# Altium schematic sheet CODEC 1 &  OUTPUT BUFFER.SchDoc: BULLSEYE
size A3; CompanyName: TYMPHANY; DrawnBy: Yetta.He; Organization: PABU; Address1: 11F,block A, CEC building,; Address2: No.2070 Shennan Zhong road,; Address3: Huaqiang North, Futian District,; Address4: Shenzhen,  Guang Dong, P.R.C 518000; DocumentNumber: 3; Revision: 0.0.5; SheetNumber: 3; SheetTotal: 7; Size: A3; Status: DP1
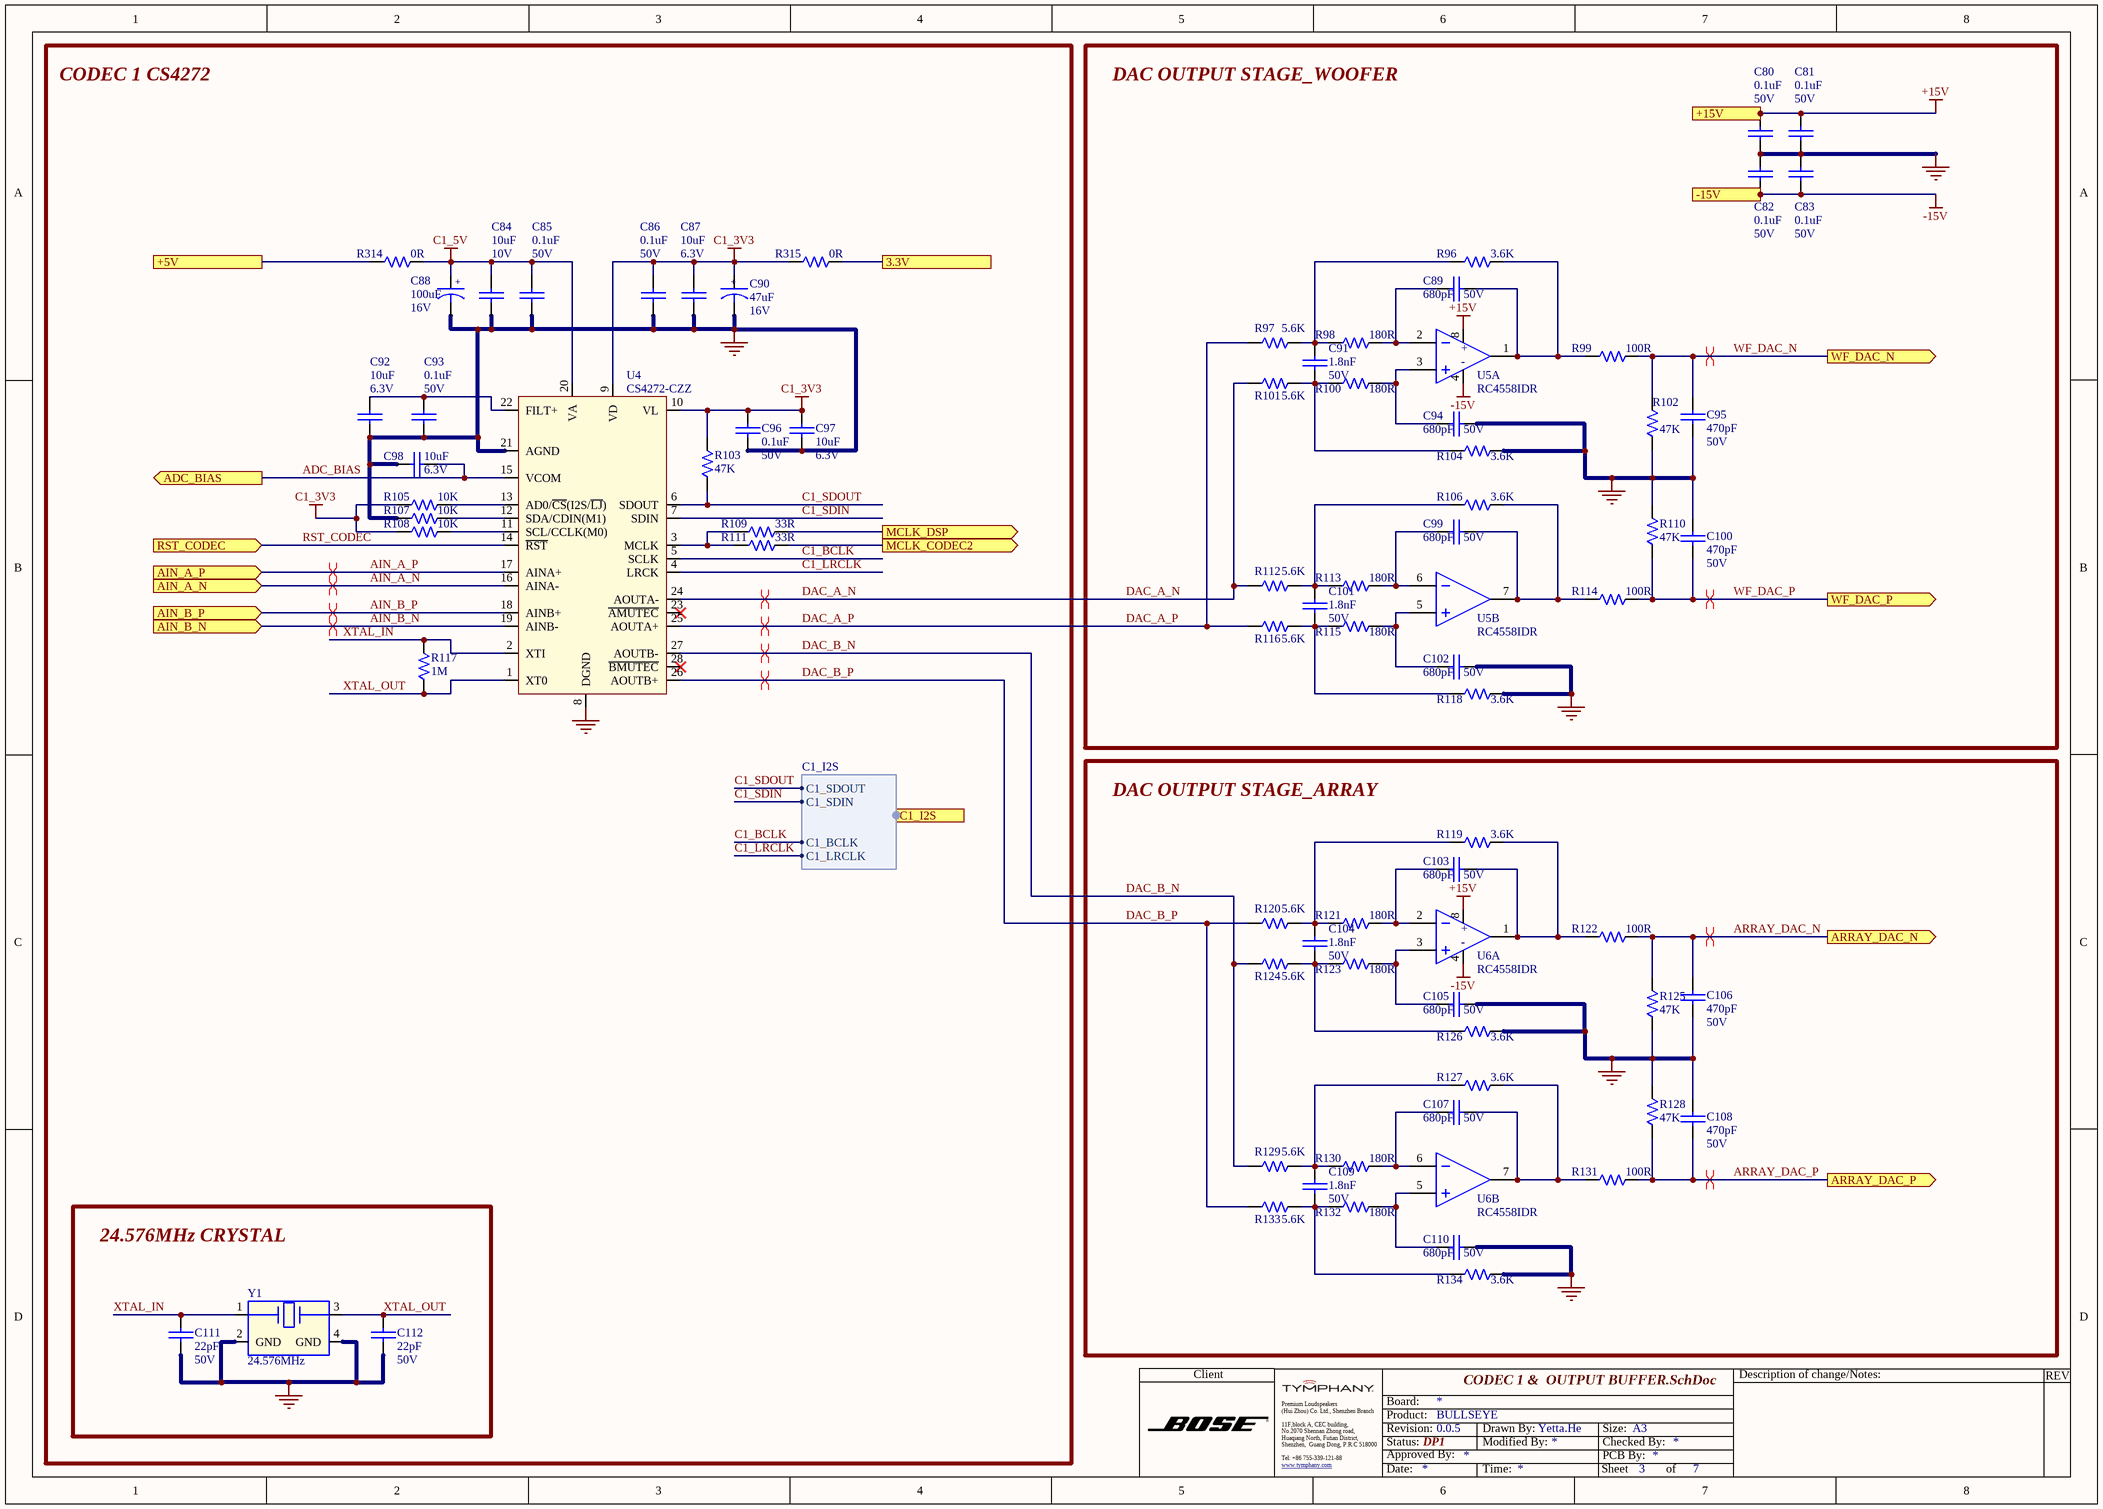
[diagram p0: CODEC 1 &  OUTPUT BUFFER.SchDoc]

## Parts
C80  value 0.1uF  Voltage: 50V  [CAPC0402-RW]  (hidden comment: PWL456470-1040)
C81  value 0.1uF  Voltage: 50V  [CAPC0402-RW]  (hidden comment: PWL456470-1040)
C82  value 0.1uF  Voltage: 50V  [CAPC0402-RW]  (hidden comment: PWL456470-1040)
C83  value 0.1uF  Voltage: 50V  [CAPC0402-RW]  (hidden comment: PWL456470-1040)
C84  value 10uF  Voltage: 10V  [CAPC0603-RW]  (hidden comment: T54000000260E)
C85  value 0.1uF  Voltage: 50V  [CAPC0402-RW]  (hidden comment: PWL456470-1040)
C86  value 0.1uF  Voltage: 50V  [CAPC0402-RW]  (hidden comment: PWL456470-1040)
C87  value 10uF  Voltage: 6.3V  [CAPC0603-RW]  (hidden comment: T54502106710E)
C88  value 100uF  Voltage: 16V  [CASE - D]  (hidden comment: T551101435040)
C89  value 680pF  Voltage: 50V  [CAPC0603-RW]  (hidden comment: PXL410372-6810)
C90  value 47uF  Voltage: 16V  [CASE - C5.7]  (hidden comment: T551470435020)
C91  value 1.8nF  Voltage: 50V  [CAPC0603-RW]  (hidden comment: PXL456470-1820)
C92  value 10uF  Voltage: 6.3V  [CAPC0603-RW]  (hidden comment: T54502106710E)
C93  value 0.1uF  Voltage: 50V  [CAPC0402-RW]  (hidden comment: PWL456470-1040)
C94  value 680pF  Voltage: 50V  [CAPC0603-RW]  (hidden comment: PXL410372-6810)
C95  value 470pF  Voltage: 50V  [CAPC0603-RW]  (hidden comment: T541024715508)
C96  value 0.1uF  Voltage: 50V  [CAPC0402-RW]  (hidden comment: PWL456470-1040)
C97  value 10uF  Voltage: 6.3V  [CAPC0603-RW]  (hidden comment: T54502106710E)
C98  value 10uF  Voltage: 6.3V  [CAPC0603-RW]  (hidden comment: T54502106710E)
C99  value 680pF  Voltage: 50V  [CAPC0603-RW]  (hidden comment: PXL410372-6810)
C100  value 470pF  Voltage: 50V  [CAPC0603-RW]  (hidden comment: T541024715508)
C101  value 1.8nF  Voltage: 50V  [CAPC0603-RW]  (hidden comment: PXL456470-1820)
C102  value 680pF  Voltage: 50V  [CAPC0603-RW]  (hidden comment: PXL410372-6810)
C103  value 680pF  Voltage: 50V  [CAPC0603-RW]  (hidden comment: PXL410372-6810)
C104  value 1.8nF  Voltage: 50V  [CAPC0603-RW]  (hidden comment: PXL456470-1820)
C105  value 680pF  Voltage: 50V  [CAPC0603-RW]  (hidden comment: PXL410372-6810)
C106  value 470pF  Voltage: 50V  [CAPC0603-RW]  (hidden comment: T541024715508)
C107  value 680pF  Voltage: 50V  [CAPC0603-RW]  (hidden comment: PXL410372-6810)
C108  value 470pF  Voltage: 50V  [CAPC0603-RW]  (hidden comment: T541024715508)
C109  value 1.8nF  Voltage: 50V  [CAPC0603-RW]  (hidden comment: PXL456470-1820)
C110  value 680pF  Voltage: 50V  [CAPC0603-RW]  (hidden comment: PXL410372-6810)
C111  value 22pF  Voltage: 50V  [CAPC0402-RW]  (hidden comment: PWL410370-2200)
C112  value 22pF  Voltage: 50V  [CAPC0402-RW]  (hidden comment: PWL410370-2200)
R96  value 3.6K  [0603-RW]  (hidden comment: QCF011030-3601)
R97  value 5.6K  [0603-RW]  (hidden comment: QCF011030-5601)
R98  value 180R  [0603-RW]  (hidden comment: QCF011030-1800)
R99  value 100R  [0603-RW]  (hidden comment: QCF011030-1000)
R100  value 180R  [0603-RW]  (hidden comment: QCF011030-1800)
R101  value 5.6K  [0603-RW]  (hidden comment: QCF011030-5601)
R102  value 47K  [0603-RW]  (hidden comment: QCF011030-4702)
R103  value 47K  [0603-RW]  (hidden comment: QCF011030-4702)
R104  value 3.6K  [0603-RW]  (hidden comment: QCF011030-3601)
R105  value 10K  [0402-RW]  (hidden comment: QCF161240-1002)
R106  value 3.6K  [0603-RW]  (hidden comment: QCF011030-3601)
R107  value 10K  [0402-RW]  (hidden comment: QCF161240-1002)
R108  value 10K  [0402-RW]  (hidden comment: QCF161240-1002)
R109  value 33R  [0402-RW]  (hidden comment: QCF161241-3309)
R110  value 47K  [0603-RW]  (hidden comment: QCF011030-4702)
R111  value 33R  [0402-RW]  (hidden comment: QCF161241-3309)
R112  value 5.6K  [0603-RW]  (hidden comment: QCF011030-5601)
R113  value 180R  [0603-RW]  (hidden comment: QCF011030-1800)
R114  value 100R  [0603-RW]  (hidden comment: QCF011030-1000)
R115  value 180R  [0603-RW]  (hidden comment: QCF011030-1800)
R116  value 5.6K  [0603-RW]  (hidden comment: QCF011030-5601)
R117  value 1M  [0402-RW]  (hidden comment: QCF161240-1004)
R118  value 3.6K  [0603-RW]  (hidden comment: QCF011030-3601)
R119  value 3.6K  [0603-RW]  (hidden comment: QCF011030-3601)
R120  value 5.6K  [0603-RW]  (hidden comment: QCF011030-5601)
R121  value 180R  [0603-RW]  (hidden comment: QCF011030-1800)
R122  value 100R  [0603-RW]  (hidden comment: QCF011030-1000)
R123  value 180R  [0603-RW]  (hidden comment: QCF011030-1800)
R124  value 5.6K  [0603-RW]  (hidden comment: QCF011030-5601)
R125  value 47K  [0603-RW]  (hidden comment: QCF011030-4702)
R126  value 3.6K  [0603-RW]  (hidden comment: QCF011030-3601)
R127  value 3.6K  [0603-RW]  (hidden comment: QCF011030-3601)
R128  value 47K  [0603-RW]  (hidden comment: QCF011030-4702)
R129  value 5.6K  [0603-RW]  (hidden comment: QCF011030-5601)
R130  value 180R  [0603-RW]  (hidden comment: QCF011030-1800)
R131  value 100R  [0603-RW]  (hidden comment: QCF011030-1000)
R132  value 180R  [0603-RW]  (hidden comment: QCF011030-1800)
R133  value 5.6K  [0603-RW]  (hidden comment: QCF011030-5601)
R134  value 3.6K  [0603-RW]  (hidden comment: QCF011030-3601)
R314  value 0R  [0603-RW]  (hidden comment: T502000002009)
R315  value 0R  [0603-RW]  (hidden comment: T502000002009)
U4  RCI004272-0001  [TSSOP28]  (value not drawn)
U5  T610500019101  [D(R-PDSO-G8)]  (value not drawn)  (parts A,B of 2)
U6  T610500019101  [D(R-PDSO-G8)]  (value not drawn)  (parts A,B of 2)
Y1  Frequency: 24.576MHz  [SMD2520]  (hidden comment: T690900003500)

## Blocks framed on the sheet
CODEC 1 CS4272: C84-C88 C90 C92 C93 C96-C98 R103 R105 R107-R109 R111 R117 R314 R315 U4
DAC OUTPUT STAGE_WOOFER: C80-C83 C89 C91 C94 C95 C99-C102 R96-R102 R104 R106 R110 R112-R116 R118 U5
DAC OUTPUT STAGE_ARRAY: C103-C110 R119-R134 U6
24.576MHz CRYSTAL: C111 C112 Y1

## Ports
3.3V, +5V, +15V, -15V, ADC_BIAS (out), AIN_A_N (in), AIN_A_P (in), AIN_B_N (in), AIN_B_P (in), ARRAY_DAC_N (out), ARRAY_DAC_P (out), C1_I2S (in, harness C1_I2S), MCLK_CODEC2 (out), MCLK_DSP (out), RST_CODEC (in), WF_DAC_N (out), WF_DAC_P (out)

## Harnesses
C1_I2S: C1_SDOUT, C1_SDIN, C1_BCLK, C1_LRCLK

## Nets
+15V: C80.1 C81.1 U5.8(VCC+) U6.8(VCC+) ; port +15V
-15V: C82.2 C83.2 U5.4(VCC-) U6.4(VCC-) ; port -15V
C1_3V3: C86.1 C87.1 C90.1 C96.2 C97.2 R103.2 R105.1 R108.1 R315.1 U4.9(VD) U4.10(VL)
C1_5V: C84.1 C85.1 C88.1 R314.2 U4.20(VA)
GND: C80.2 C81.2 C82.1 C83.1 C84.2 C85.2 C86.2 C87.2 C88.2 C90.2 C92.1 C93.2 C94.2 C95.2 C96.1 C97.1 C98.2 C100.1 C102.2 C105.2 C106.2 C108.1 C110.2 C111.2 C112.2 R102.1 R104.2 R107.1 R110.2 R118.2 R125.1 R126.2 R128.2 R134.2 U4.8(DGND) U4.21(AGND) Y1.2(GND) Y1.4(GND)
3.3V: R315.2 ; port 3.3V
+5V: R314.1 ; port +5V
ADC_BIAS: C98.1 U4.15(VCOM) ; port ADC_BIAS
AIN_A_N: U4.16(AINA-) ; port AIN_A_N
AIN_A_P: U4.17(AINA+) ; port AIN_A_P
AIN_B_N: U4.19(AINB-) ; port AIN_B_N
AIN_B_P: U4.18(AINB+) ; port AIN_B_P
ARRAY_DAC_N: C106.1 R122.2 R125.2 ; port ARRAY_DAC_N
ARRAY_DAC_P: C108.2 R128.1 R131.2 ; port ARRAY_DAC_P
C1_BCLK: U4.5(SCLK) ; port C1_I2S.C1_BCLK
C1_LRCLK: U4.4(LRCK) ; port C1_I2S.C1_LRCLK
C1_SDIN: U4.7(SDIN) ; port C1_I2S.C1_SDIN
C1_SDOUT: R103.1 U4.6(SDOUT) ; port C1_I2S.C1_SDOUT
DAC_A_N: R101.1 R112.1 U4.24(AOUTA-)
DAC_A_P: R97.1 R116.1 U4.25(AOUTA+)
DAC_B_N: R124.1 R129.1 U4.27(AOUTB-)
DAC_B_P: R120.1 R133.1 U4.26(AOUTB+)
MCLK_CODEC2: R111.2 ; port MCLK_CODEC2
MCLK_DSP: R109.2 ; port MCLK_DSP
RST_CODEC: U4.14(~{RST}) ; port RST_CODEC
WF_DAC_N: C95.1 R99.2 R102.2 ; port WF_DAC_N
WF_DAC_P: C100.2 R110.1 R114.2 ; port WF_DAC_P
XTAL_IN: C111.1 R117.2 U4.2(XTI) Y1.1
XTAL_OUT: C112.1 R117.1 U4.1(XT0) Y1.3
NetC89_1: C89.1 R98.2 U5.2(1IN-)
NetC89_2: C89.2 R96.2 R99.1 U5.1(1OUT)
NetC91_1: C91.1 R96.1 R97.2 R98.1
NetC91_2: C91.2 R100.1 R101.2 R104.1
NetC92_2: C92.2 C93.1 U4.22(FILT+)
NetC94_1: C94.1 R100.2 U5.3(1IN+)
NetC99_1: C99.1 R113.2 U5.6(2IN-)
NetC99_2: C99.2 R106.2 R114.1 U5.7(2OUT)
NetC101_1: C101.1 R106.1 R112.2 R113.1
NetC101_2: C101.2 R115.1 R116.2 R118.1
NetC102_1: C102.1 R115.2 U5.5(2IN+)
NetC103_1: C103.1 R121.2 U6.2(1IN-)
NetC103_2: C103.2 R119.2 R122.1 U6.1(1OUT)
NetC104_1: C104.1 R119.1 R120.2 R121.1
NetC104_2: C104.2 R123.1 R124.2 R126.1
NetC105_1: C105.1 R123.2 U6.3(1IN+)
NetC107_1: C107.1 R130.2 U6.6(2IN-)
NetC107_2: C107.2 R127.2 R131.1 U6.7(2OUT)
NetC109_1: C109.1 R127.1 R129.2 R130.1
NetC109_2: C109.2 R132.1 R133.2 R134.1
NetC110_1: C110.1 R132.2 U6.5(2IN+)
NetR105_2: R105.2 U4.13(AD0/~{CS}(I2S/~{LJ}))
NetR107_2: R107.2 U4.12(SDA/CDIN(M1))
NetR108_2: R108.2 U4.11(SCL/CCLK(M0))
NetR109_1: R109.1 R111.1 U4.3(MCLK)

Not connected (* = marked no-connect by the designer): U4 23(~{AMUTEC})* 28(~{BMUTEC})*

## Layout directives
differential pair: AIN_A_N, AIN_A_P, AIN_B_N, AIN_B_P, ARRAY_DAC_N, ARRAY_DAC_P, DAC_A_N, DAC_A_P, DAC_B_N, DAC_B_P, WF_DAC_N, WF_DAC_P

## Notes on the sheet
- Client
- Description of change/Notes:
- REV
- Premium Loudspeakers
- (Hui Zhou) Co. Ltd., Shenzhen Branch
- Tel: +86 755-339-121-88
- Board:
- Status:
- Revision:
- Product:
- Approved By:
- Drawn By:
- Modified By:
- Checked By:
- PCB By:
- Size:
- www.tymphany.com <http://www.tymphany.com>
- Date:
- Time:
- Sheet
- of
- (in symbol CAP E 47uF 16V 20% SMD_VEJ470M1CTR-0506) +
- (in symbol CAP E 100uF 16V 20% SMD-VZH101M1CTR-0605) +
- (in symbol RC4558IDR, part A) +; -

## Library data of the parts
C80-C83 = CAP0402 0.1uF 50V 10%: CAP, CER, 0.1uF, 10%, 50V, X7R, 0402, RoHS; SAP: T542011047508; Type: Capacitor; CREATE_NAME: TOM@Deftronics; PACKAGE: CAPC0402; Vendor Name: *; MFG: *; MFG Part: *; Other: X7R; Tolerance: 10%; CREATE_TIME: 13-May-2014
C84 = CAP0603 10uF 10V 20%_X5R_SAMSUNG: CAP 10UF 10V +-20% 0603X5R SAMSUNG L; Other: X5R; Tolerance: 20%,; Type: Capacitor; CREATE_NAME: Nathan; DIP&SMD: SMD; SAP: T54000000260E; PACKAGE: CAPC0603; Vendor Code: *; Vendor Name: *; MFG: SAMSUNG; MFG Part: *; CREATE_TIME: 16-Feb-2019; Customer Specific: N/A
C85 C86 C93 C96 = CAP0402 0.1uF 50V 10%: CAP X7R .10UF 50V +-10% 0402 WALSIN L; SAP: T542011047508; Tolerance: 10%; Type: Capacitor; CREATE_NAME: TOM@Deftronics; DIP&SMD: SMD; PACKAGE: CAPC0402; Vendor Name: *; MFG: *; MFG Part: *; Other: X7R; CREATE_TIME: 13-May-2014; Customer Specific: N/A
C87 C92 C97 C98 = CAP0603 10uF 6.3V 10%_X5R_SAMSUNG: CAP X5R 10UF 6.3V +-10% 0603 SAMSUN L; MFG Part: CL10A106KQ8NNNC; Tolerance: 10%; Type: Capacitor; CREATE_NAME: Nathan; DIP&SMD: SMD; SAP: T54502106710E; PACKAGE: CAPC0603; Vendor Code: *; Vendor Name: *; MFG: SAMSUNG; Other: X5R; CREATE_TIME: 30-Oct-2018; Customer Specific: N/A
C88 = CAP E 100uF 16V 20% SMD-VZH101M1CTR-0605: E 100UF 16V +-20% 6.3*5. VZH101M1C L; MFG: LELON; Type: Capacitor; CREATE_NAME: Nathan; DIP&SMD: SMD; Tolerance: 20%; SAP: T551101435040; PACKAGE: CASE - D; MFG Part: VZH101M1CTR-0605; Other: *; CREATE_TIME: 03-May-2019; Customer Specific: N/A; Vendor Name: *; Vendor Code: *
C89 C94 C99 C102 C103 C105 C107 C110 = CAP0603 680pF 50V 5% - PXL410372-6810: GP CHIP CAP 680pF 50V 5% 0603 NPO; SAP: T541026816508; Vendor Code: 10010262; Vendor Name: 东莞市晴远电子有限公司; Type: Capacitor; DIP&SMD: SMD; PACKAGE: CAPC0603; MFG: *; MFG Part: *; Other: NPO; Tolerance: 5%; Customer Specific: N/A
C90 = CAP E 47uF 16V 20% SMD_VEJ470M1CTR-0506: E 47UF 16V +-20% 5X6 VEJ470M1C K; MFG: LELON; Tolerance: 20%; Type: Capacitor; DIP&SMD: SMD; CREATE_NAME: Nathan; SAP: T551470435020; PACKAGE: CASE - C5.7; Vendor Name: *; Vendor Code: *; MFG Part: VEJ470M1CTR-0506; Other: *; Customer Specific: N/A; CREATE_TIME: 15-Mar-2019
C91 C101 C104 C109 = CAP0603 1.8nF 50V 10%: CHIP CAP 1.8nF 50V 10% 0603 X7R; SAP: T542021827508; MFG: 海能达; Type: Capacitor; PACKAGE: CAPC0603; Vendor Code: *; Vendor Name: *; MFG Part: *; Other: X7R; Tolerance: 10%
C95 C100 C106 C108 = CAP0603 470pF 50V 2%_NPO_WALSIN: CAP NPO 470PF 50V +-2% 0603 WALSIN L; Tolerance: 2%; Type: Capacitor; DIP&SMD: SMD; CREATE_NAME: Nathan; SAP: T541024715508; PACKAGE: CAPC0603; Vendor Name: *; MFG: WALSIN; MFG Part: *; Other: NPO; Customer Specific: N/A; CREATE_TIME: 13-July-2016
C111 C112 = CAP0402 22pF 50V 5%: CHIP CAP 5% 50V 0402 NPO 22pF; SAP: T541012206508; Type: Capacitor; CREATE_NAME: GordonL@Deftronics; DIP&SMD: SMD; PACKAGE: CAPC0402; Vendor Code: *; Vendor Name: *; MFG: *; MFG Part: *; Other: NPO; Tolerance: 5%; CREATE_TIME: 08-MAR-2013; Customer Specific: N/A
R96 R104 R106 R118 R119 R126 R127 R134 = RES0603 1/10W 1% 3.6K OHM: GP CHIP RES. 3.6K OHM 1/10W 1% 0603; Vendor Code: 10010262; SAP: T502360102399; Vendor Name: 东莞市晴远电子有限公司; DIP&SMD: SMD; Power: 1/10W; MFG: *; MFG Part: *; TOL: 1%; Type: Resistor; PACKAGE: 0603; Customer Specific: N/A
R97 R101 R112 R116 R120 R124 R129 R133 = RES0603 1/10W 1% 5.6K OHM: GP CHIP RES. 5.6K OHM 1/10W 1% 0603; Vendor Code: 10010262; SAP: T502560102399; Vendor Name: 东莞市晴远电子有限公司; DIP&SMD: SMD; Power: 1/10W; MFG Part: *; MFG: *; TOL: 1%; Type: Resistor; PACKAGE: 0603; Customer Specific: N/A
R98 R100 R113 R115 R121 R123 R130 R132 = RES0603 1/10W 1% 180 OHM: CHIP RES. 180 OHM 1/10W 1% 0603; Vendor Code: 10010262; SAP: T502180002399; Vendor Name: 东莞市晴远电子有限公司; DIP&SMD: SMD; Power: 1/10W; MFG Part: *; MFG: *; TOL: 1%; Type: Resistor; PACKAGE: 0603; Customer Specific: N/A
R99 R114 R122 R131 = RES0603 1/10W 1% 100 OHM: CHIP 100 OHM 100PPM +-1% 0603 WALS L; Vendor Code: 10010262; SAP: T502100002399; Power: 1/10W; Vendor Name: 东莞市晴远电子有限公司; MFG: WALSIN (華新); TOL: 1%; DIP&SMD: SMD; MFG Part: *; Type: Resistor; PACKAGE: 0603; Customer Specific: N/A
R102 R103 R110 R125 R128 = RES0603 1/10W 1% 47K OHM: GP CHIP RES. 47K OHM 1/10W 1% 0603; Vendor Code: 10010262; SAP: T502470202399; Vendor Name: 东莞市晴远电子有限公司; DIP&SMD: SMD; Power: 1/10W; MFG Part: *; MFG: *; TOL: 1%; Type: Resistor; PACKAGE: 0603; Customer Specific: N/A
R105 R107 R108 = RES0402 1/16W 1% 10K OHM: CHIP RES 10K OHM 1/16W 1% 0402; SAP: T502100201399; MFG: WALSIN; DIP&SMD: SMD; Vendor Code: *; Power: 1/16W; Vendor Name: *; MFG Part: *; TOL: 1%; Type: Resistor; PACKAGE: 0402; Customer Specific: N/A
R109 R111 = RES0402 1/16W 1% 33 OHM: CHIP RES 33 OHM 1/16W 1% 0402; SAP: T502330A01399; MFG: WALSIN; DIP&SMD: SMD; Vendor Code: *; Power: 1/16W; Vendor Name: *; MFG Part: *; TOL: 1%; Type: Resistor; PACKAGE: 0402; Customer Specific: N/A
R117 = RES0402 1/16W 1% 1M OHM: CHIP RES 1M OHM 1/16W 1% 0402; SAP: T502100401399; MFG: WALSIN; DIP&SMD: SMD; Vendor Code: *; Power: 1/16W; Vendor Name: *; MFG Part: *; TOL: 1%; Type: Resistor; PACKAGE: 0402; Customer Specific: N/A
R314 R315 = RES0603 1/10W 0 OHM_WALSIN: CHIP 0 OHM 0 OHM 0 OHM 0603 WALSIN L; MFG Part: WR06X000PTL; Power: 1/10W; MFG: WALSIN (華新); DIP&SMD: SMD; Vendor Code: *; SAP: T502000002009; Vendor Name: *; TOL: *; Type: Resistor; PACKAGE: 0603; Customer Specific: N/A
U4 = CS4272-CZZ: IC CODEC CS4272-CZZ TSSOP-28; SAP: T611500002006; MFG: CIRRUS LOGIC; CREATE_NAME: GordonL@Deftronics; DIP&SMD: SMD; Vendor Name: *; Vendor Code: *; CREATE_TIME: 31-MAY-2013; Type: IC; Customer Specific: N/A; MFG Part: CS4272-CZZ
U5 U6 = RC4558IDR: OP RC4558IDR SOP-8 TI G; CREATE_NAME: Nathan; DIP&SMD: SMD; CREATE_TIME: 16-Aug-2017; MFG: TI; SAP: T610500019101; TYPE: IC; Value: *; Vendor Code: *; Vendor Name: *; Customer Specific: N/A; MFG Part: RC4558IDR
Y1 = CRY 24.576MHz_XTL571200-F98-048: CRYSTAL 24.576MH SMD SIWARD XTL571200-F98-048 G; CREATE_NAME: Nathan; SAP: T690900003500; MFG Part: XTL571200-F98-048; MFG: SIWARD; Vendor Code: *; Vendor Name: *; Frequency Tolerance: *; Eqivalent resistance: *; Type: Crystal; Capacitance: *; CREATE_TIME: 21-Feb-2017; DIP&SMD: SMD